# EAGLE design LSM6DS3Board1 (EAGLE 7.7.0)
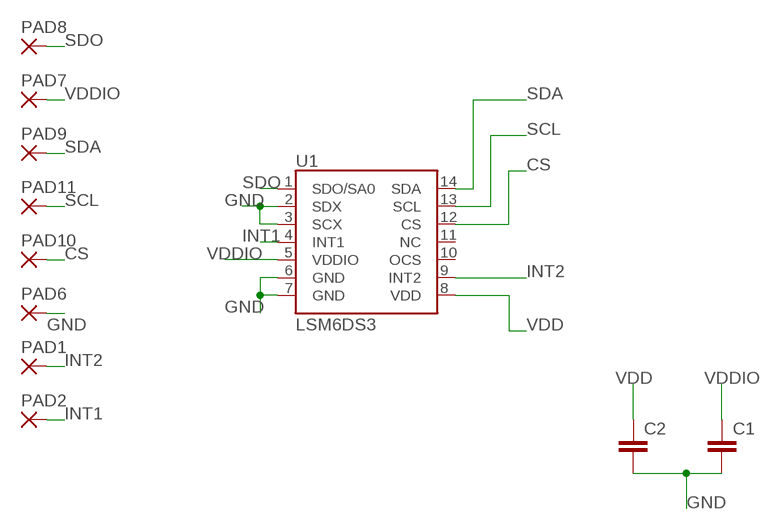
[diagram p0: schematic, sheet 1]

## Parts
C1  C-EUC0603  [C0603]
C2  C-EUC0603  [C0603]
PAD1  1,6/0,8  [1,6/0,8]
PAD2  1,6/0,8  [1,6/0,8]
PAD6  1,6/0,8  [1,6/0,8]
PAD7  1,6/0,8  [1,6/0,8]
PAD8  1,6/0,8  [1,6/0,8]
PAD9  1,6/0,8  [1,6/0,8]
PAD10  1,6/0,8  [1,6/0,8]
PAD11  1,6/0,8  [1,6/0,8]
U1  LSM6DS3  [LGA14L]

## Nets
CS: PAD10.1(P) U1.12(CS)
GND: C1.2 C2.2 PAD6.1(P) U1.2(SDX) U1.3(SCX) U1.6(GND) U1.7(GND)
INT1: PAD2.1(P) U1.4(INT1)
INT2: PAD1.1(P) U1.9(INT2)
SCL: PAD11.1(P) U1.13(SCL)
SDA: PAD9.1(P) U1.14(SDA)
SDO: PAD8.1(P) U1.1(SDO/SA0)
VDD: C2.1 U1.8(VDD)
VDDIO: C1.1 PAD7.1(P) U1.5(VDDIO)
Unconnected: U1.10(OCS) U1.11(NC)

## Library data of the parts
C1 C2 = rcl:C-EU: CAPACITOR, European symbol
PAD1 PAD2 PAD6-PAD11 = wirepad:1,6/0,8: THROUGH-HOLE PAD
U1 = LSM6DS3:LSM6DS3

## Board
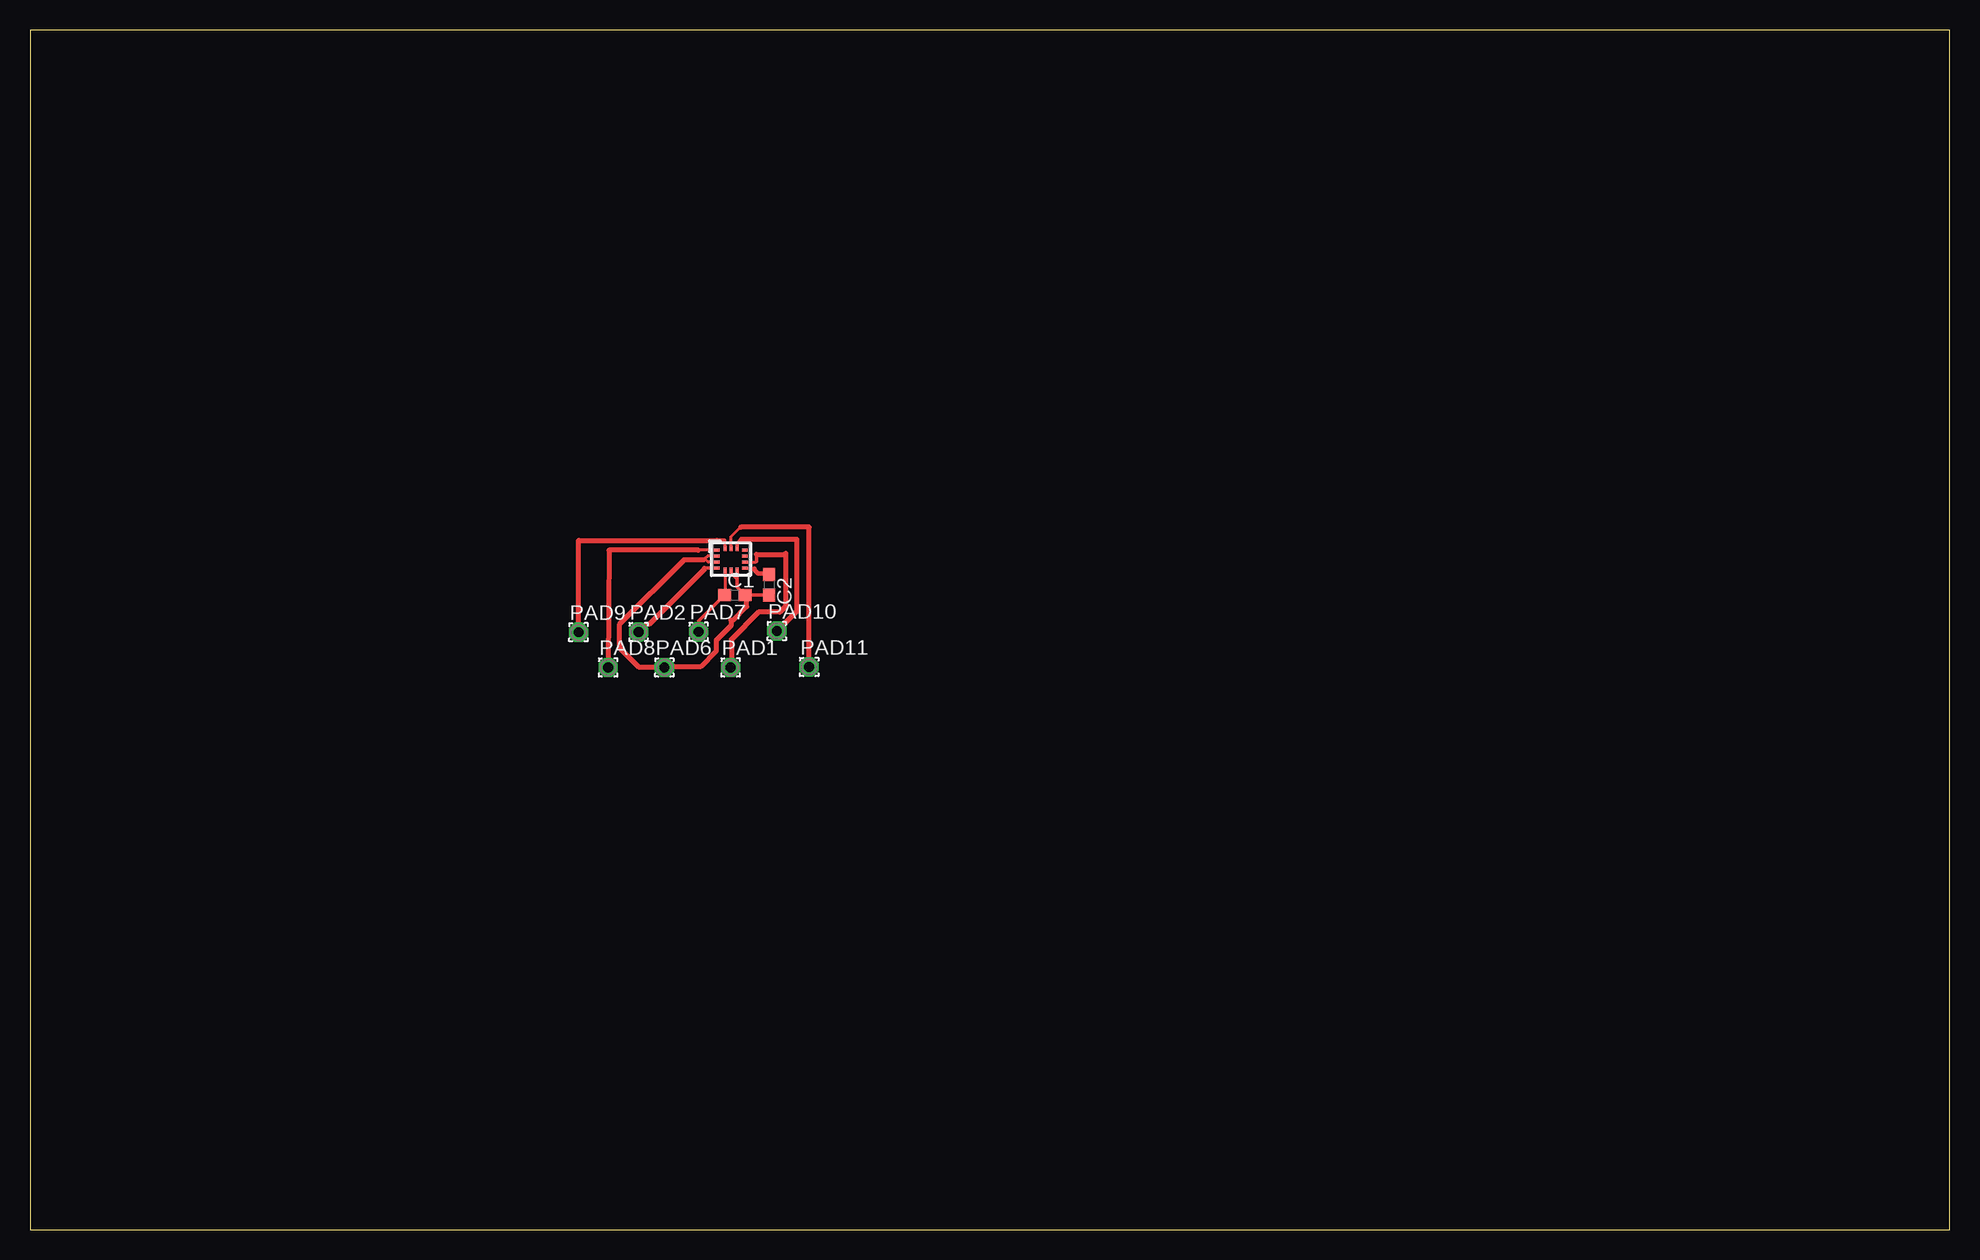
[diagram p1: board, top side]

Size 160 x 100 mm. Coordinates in mm from the lower left corner, seen from the top.
Outline: 0,0 160,0 160,100 0,100 0,0
Copper layers (1*16): Top 0.035mm / dielectric 1.5mm / Bottom 0.035mm
Design rules "SparkFun *": minimum track width 8mil, minimum drill 20mil, track to track 4mil, track to pad 4mil, pad to pad 8mil, via to via 8mil, smd to smd 8mil, copper to edge 8mil, drill to drill 8mil, minimum pad ring 12mil, minimum via ring 10mil, stop-mask expansion 4mil, vias tented up to drill 20mil, thermal gap 10mil

### Footprints (pad centres in the part's own frame; a part is rotated, then mirrored left to right if it is on the bottom)
C0603 = smd 1.1 x 1: 1 -0.85,0; 2 0.85,0
1,6/0,8 = drill 0.813 pad 1.6 octagon: 1 0,0
LGA14L = smd 0.45 x 0.25: 1 -1.175,0.75; 2 -1.175,0.25; 3 -1.175,-0.25; 4 -1.175,-0.75; 8 1.175,-0.75; 9 1.175,-0.25; 10 1.175,0.25; 11 1.175,0.75 | smd 0.25 x 0.45: 5 -0.5,-0.925; 6 0,-0.925; 7 0.5,-0.925; 12 0.5,0.925; 13 0,0.925; 14 -0.5,0.925

### Placement (x,y rotation side)
C1  58.75,52.88 0 top
C2  61.59,53.75 270 top
PAD1  58.39,46.86 0 top
PAD2  50.72,49.81 0 top
PAD6  52.88,46.86 0 top
PAD7  55.73,49.83 0 top
PAD8  48.18,46.86 0 top
PAD9  45.72,49.78 0 top
PAD10  62.26,49.89 0 top
PAD11  64.95,46.89 0 top
U1  58.42,55.88 0 top

### Tracks (layer width: path | path; a pad name or v marks a point on that pad's centre or on a via)
CS
  Top 0.305: U1.12 58.92,57.19 59.28,57.56
  Top 0.406: 59.28,57.56 63.91,57.56 63.91,51.54 PAD10.1
GND
  Top 0.254: U1.6 58.42,54.68 58.92,54.18 | U1.2 56.46,56.13 56.25,55.92 | 56.25,55.92 56.16,55.83 | U1.3 56.54,55.63 56.25,55.92 | 58.42,50.77 58.45,50.75
  Top 0.305: U1.7 58.92,54.18 58.92,53.56 C1.2 61.58,52.88 C2.2
  Top 0.406: 56.16,55.83 54.51,55.83 49.15,50.47 49.15,48.49 50.77,46.86 PAD6.1 52.93,46.91 55.88,46.91 57.2,48.23 57.2,49.12 58.45,50.37 58.45,50.75 | 58.42,50.77 58.6,50.77 59.74,51.92 59.74,52.74 C1.2
INT1
  Top 0.305: U1.4 56.22,55.13 56.21,55.12
  Top 0.406: 56.21,55.12 56.21,55.07 51.59,50.44 51.36,50.44 PAD2.1
INT2
  Top 0.254: 60.55,55.68 60.51,55.63 U1.9
  Top 0.305: 60.55,55.68 60.55,56.29
  Top 0.406: 60.55,56.29 62.89,56.29 62.99,56.39 62.99,51.94 62.51,51.46 60.73,51.46 58.47,49.2 58.47,46.94 PAD1.1
SCL
  Top 0.254: U1.13 58.42,57.76 59.18,58.52
  Top 0.305: 59.23,58.52 59.18,58.52
  Top 0.406: PAD11.1 64.95,58.52 64.97,58.55 59.26,58.55 59.23,58.52
SDA
  Top 0.254: U1.14 57.92,57.47 57.91,57.48 57.28,57.48 57.25,57.45
  Top 0.305: 57.25,57.45 57.27,57.45
  Top 0.406: PAD9.1 45.72,57.43 45.74,57.45 57.25,57.45
SDO
  Top 0.254: U1.1 55.74,56.63 55.73,56.64
  Top 0.406: 48.39,56.63 48.39,56.64 | 48.39,56.64 48.26,56.64 PAD8.1 | 55.73,56.64 48.39,56.64
VDD
  Top 0.254: U1.8 60.39,55.13 60.4,55.12
  Top 0.356: 60.4,55.12 60.4,54.99 60.71,54.69 61.51,54.69 C2.1
VDDIO
  Top 0.254: U1.5 57.92,52.9
  Top 0.305: 57.92,52.9 C1.1 55.73,50.71 PAD7.1